# Altium schematic sheet dc driver sch.SchDoc
size A4; SheetNumber: 1; SheetTotal: 1
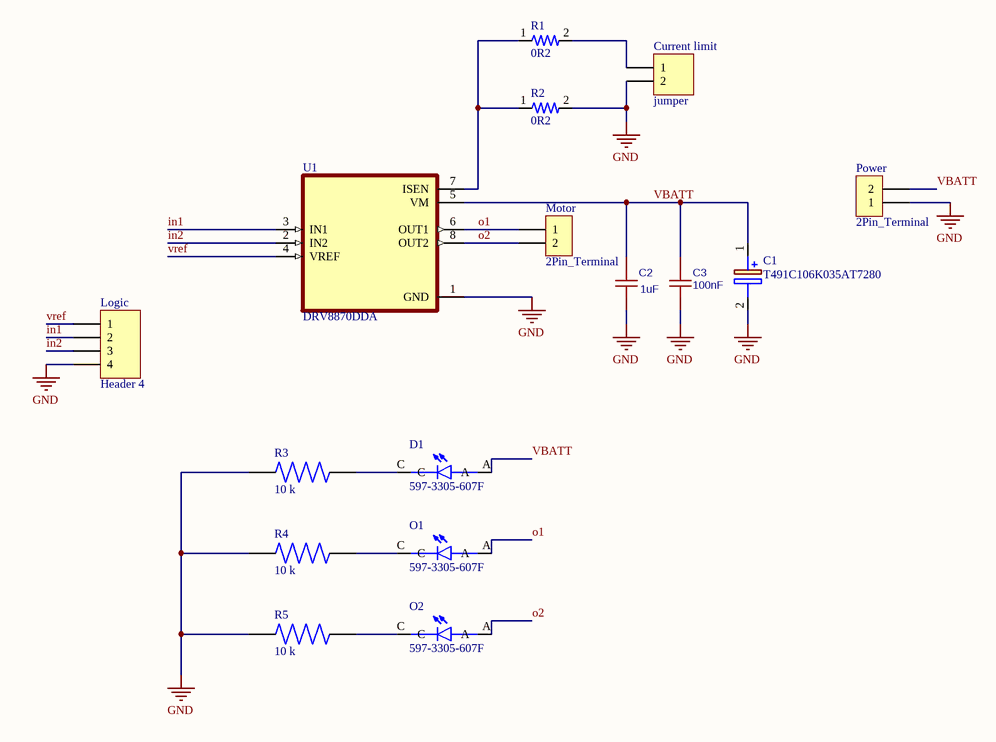
[diagram p0: dc driver sch.SchDoc]

## Parts
C1  T491C106K035AT7280  [T491C]
C2  1uF  [CAP0805]
C3  100nF  [CAP0603]
Current_limit  jumper  [HDR1X2]
D1  597-3305-607F  [LEDC2012X70N]
Logic  Header 4  [HDR1X4]
Motor  2Pin_Terminal  [2Pin_Terminal]
O1  597-3305-607F  [LEDC2012X70N]
O2  597-3305-607F  [LEDC2012X70N]
Power  2Pin_Terminal  [2Pin_Terminal]
R1  0R2  [RESC6432X60N]
R2  0R2  [RESC6432X60N]
R3  10 k  [603res]
R4  10 k  [603res]
R5  10 k  [603res]
U1  DRV8870DDA  [motor driver]

## Nets
GND: C1.2(-) C2.1 C3.1 Current_limit.2 Logic.4 Power.1 R2.2 R3.1 R4.1 R5.1 U1.1(GND)
in1: Logic.2 U1.3(IN1)
in2: Logic.3 U1.2(IN2)
o1: Motor.1 O1.A U1.6(OUT1)
o2: Motor.2 O2.A U1.8(OUT2)
VBATT: C1.1(+) C2.2 C3.2 D1.A Power.2 U1.5(VM)
vref: Logic.1 U1.4(VREF)
NetCurrent_limit_1: Current_limit.1 R1.2
NetD1_C: D1.C R3.2
NetO1_C: O1.C R4.2
NetO2_C: O2.C R5.2
NetR1_1: R1.1 R2.1 U1.7(ISEN)

Not connected (* = marked no-connect by the designer): U1 9(GND) 10(GND) 11(GND) 12(GND) 13(GND) 14(GND) 15(GND) 16(GND) 17(GND)

## Library data of the parts
C1 = T491C106K035AT7280: Capacitor Polarised; Manufacturer_Name: KEMET; Datasheet Link: https://content.kemet.com/datasheets/KEM_T2005_T491.pdf; Height: 2.8mm; Manufacturer_Part_Number: T491C106K035AT7280; Mouser Part Number: 80-T491C106K035AT; Mouser Price/Stock: https://www.mouser.co.uk/ProductDetail/KEMET/T491C106K035AT7280?qs=xy9o06WtvdC%2Fe0IkQj9vgQ%3D%3D; Arrow Part Number: T491C106K035AT7280; Arrow Price/Stock: https://www.arrow.com/en/products/t491c106k035at7280/kemet-corporation?region=nac
C2 = 0.1u_4: CAP0805; nameAlias: Value(F); Manufacturer Part: ?; spicePre: C; spiceSymbolName: Capacitor; Value: 1uF
C3 = 0.1u: CAP0603; nameAlias: Value(F); Manufacturer Part: ?; spicePre: C; spiceSymbolName: Capacitor; Value: 100nF
Current_limit = Header 2: Header, 2-Pin; LatestRevisionDate: 17-Jul-2002; LatestRevisionNote: Re-released for DXP Platform.; Publisher: Altium Limited
D1 O1 O2 = 597-3305-607F: LED Uni-Color Green 4-Pin Chip 0805 T/R; Availability: Unavailable; Value: *; Price: None; MP: 597-3305-607F; Package: None
Logic = Header 4: Header, 4-Pin; LatestRevisionDate: 17-Jul-2002; LatestRevisionNote: Re-released for DXP Platform.; Publisher: Altium Limited
R1 R2 = TLR3A20DR004FTDG: Metal Strip Smnt Fixed Resistor 2512 Case 4mOhm +/-1% 2W +/-50ppm/degC; Package: None; Price: None; Value: 0R2; MP: TLR3A20DR004FTDG; Availability: Unavailable
R3-R5 = RN731JTTD3701D25: 603 Resistor; Package: None; Price: None; Value: 10 k; MP: RN731JTTD3701D25; Availability: Unavailable
U1 = DRV8870DDA: Package: None; Price: None; Value: *; MP: DRV8870DDA; Availability: Unavailable